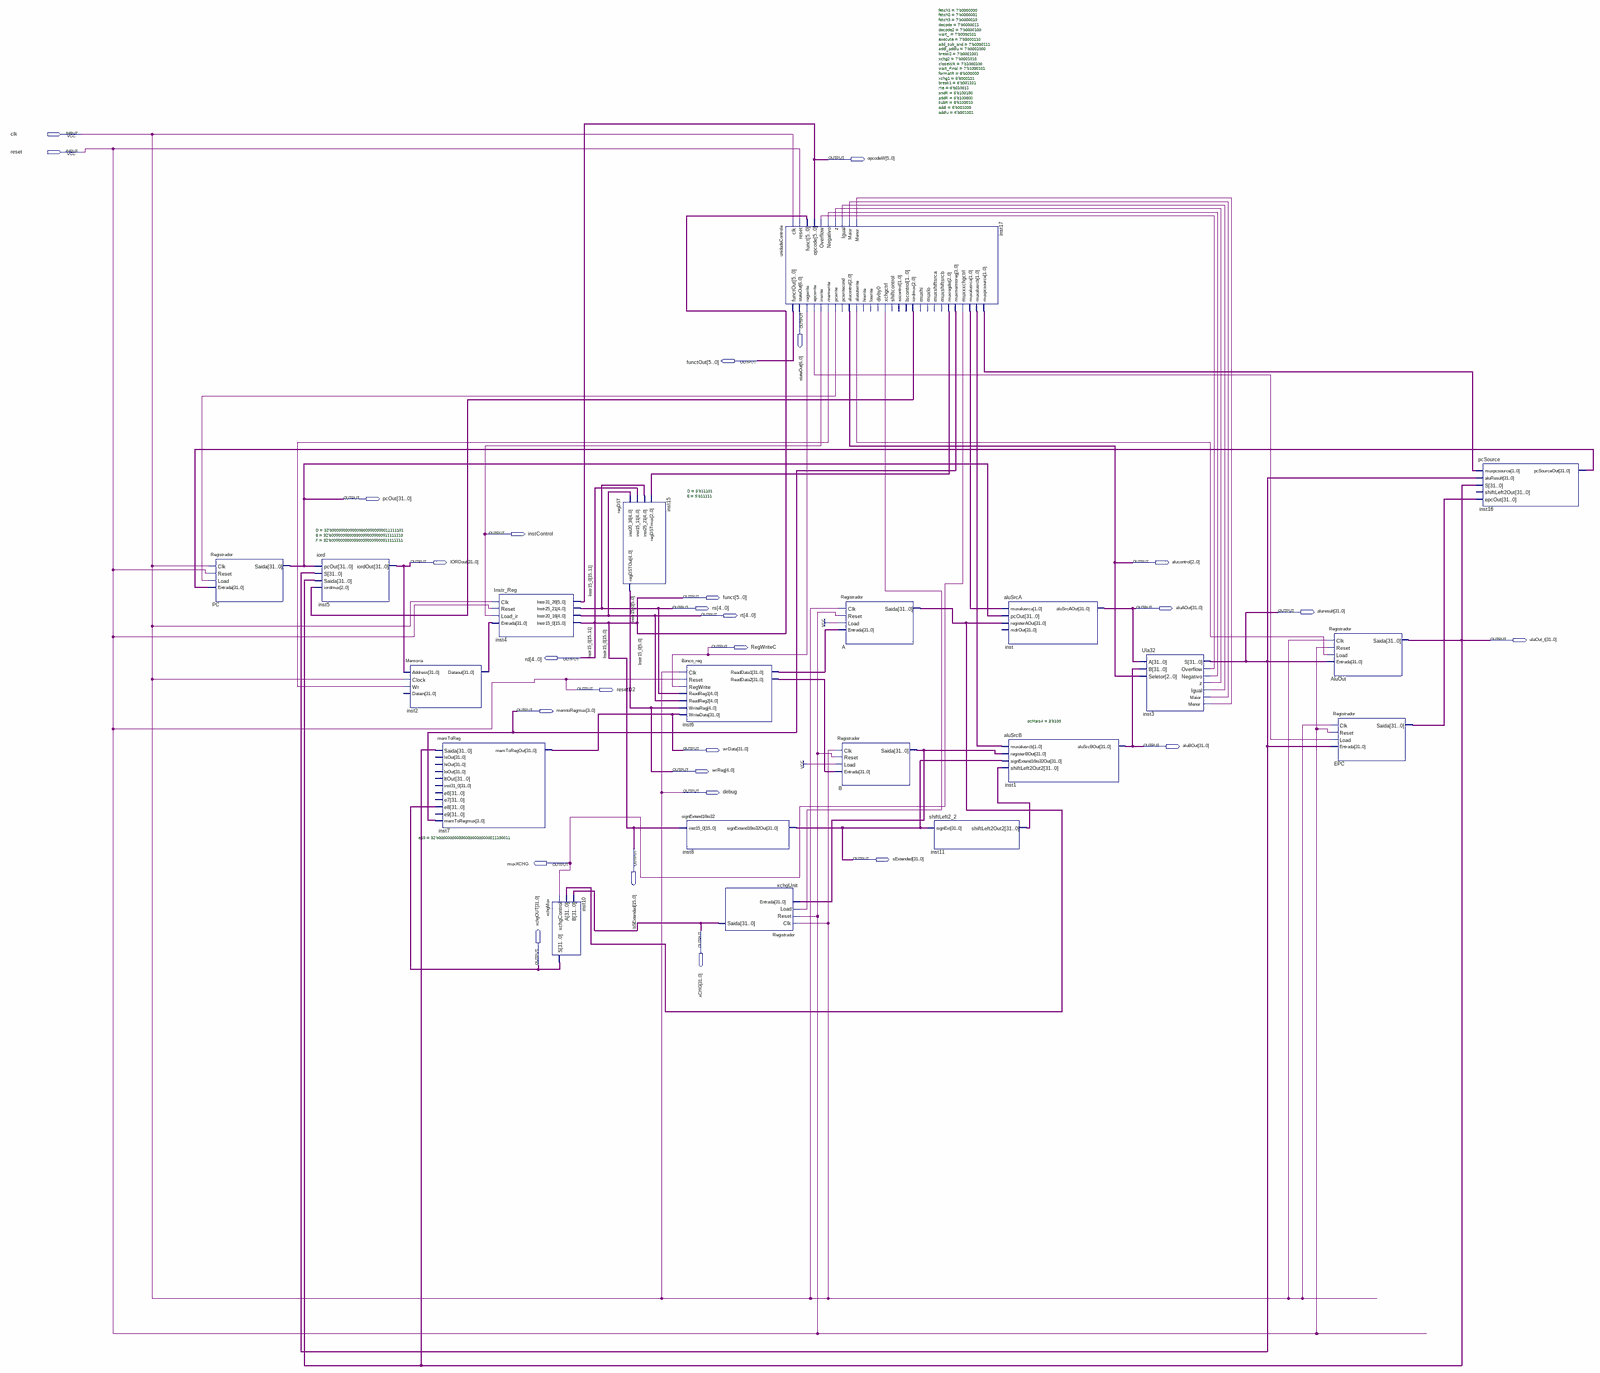
[diagram p0: schematic sheet, whole]
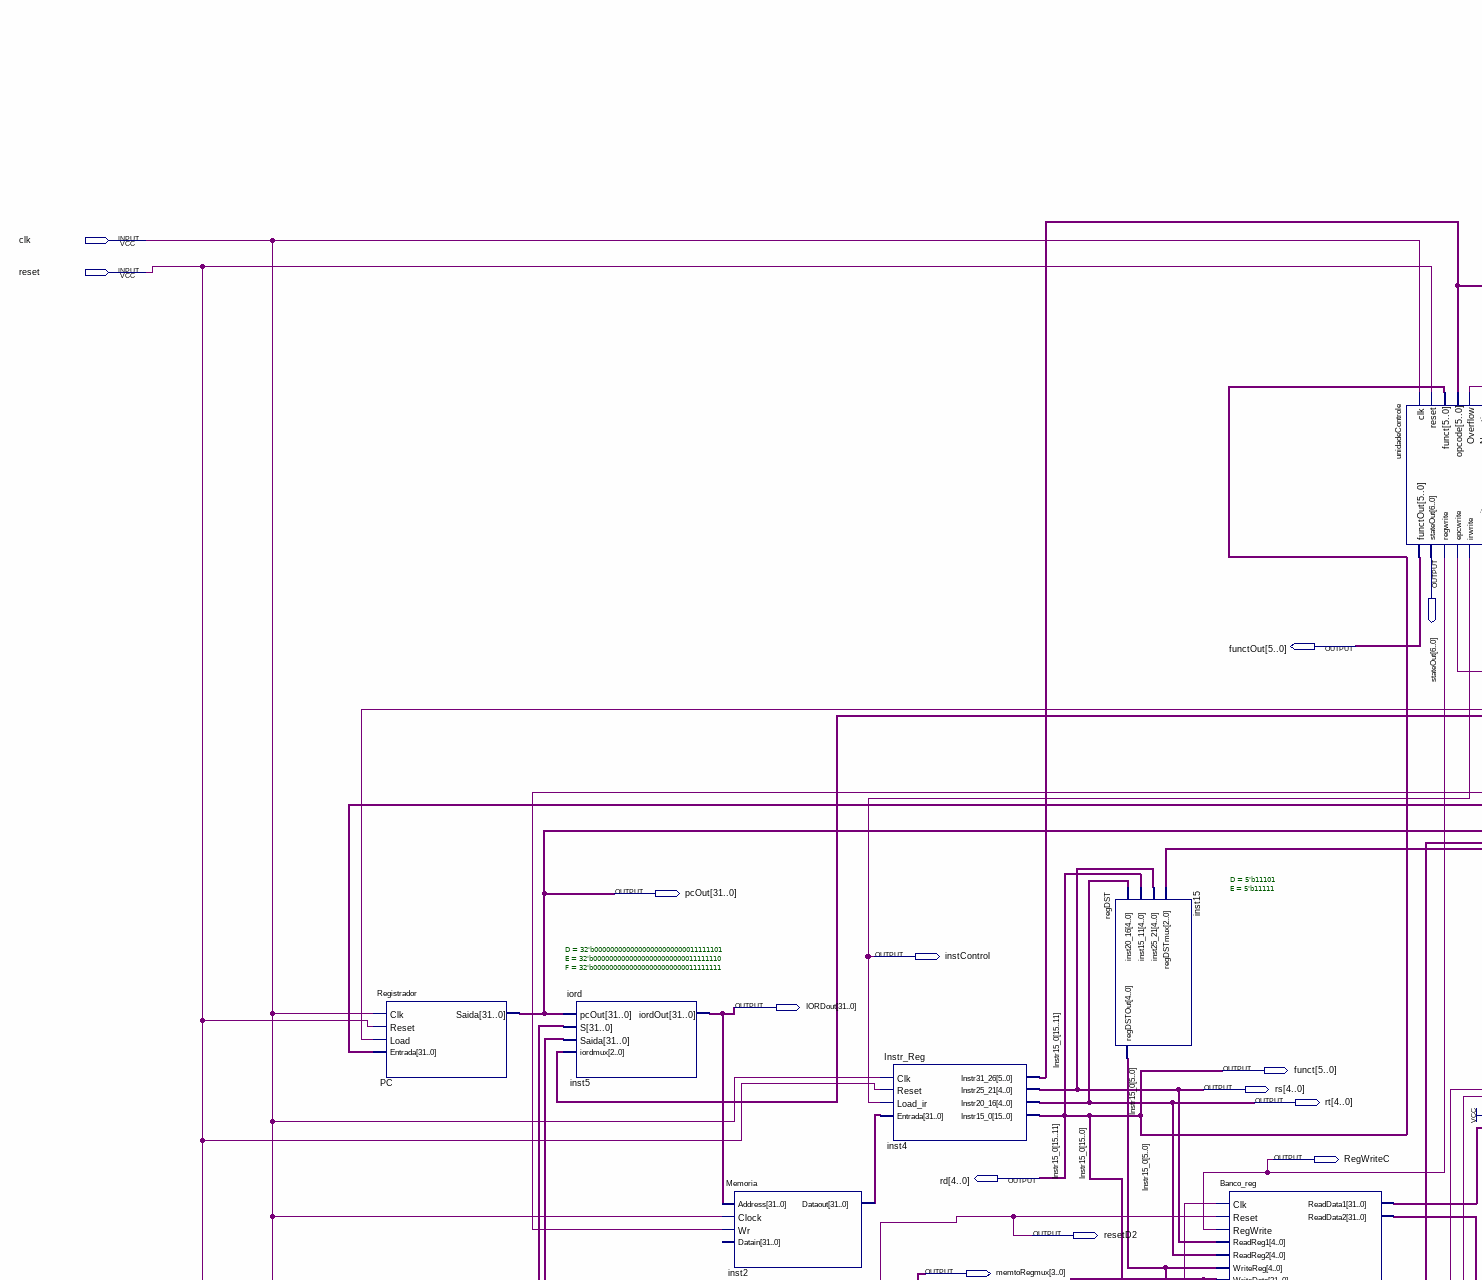
[diagram p1: schematic sheet, upper left part]
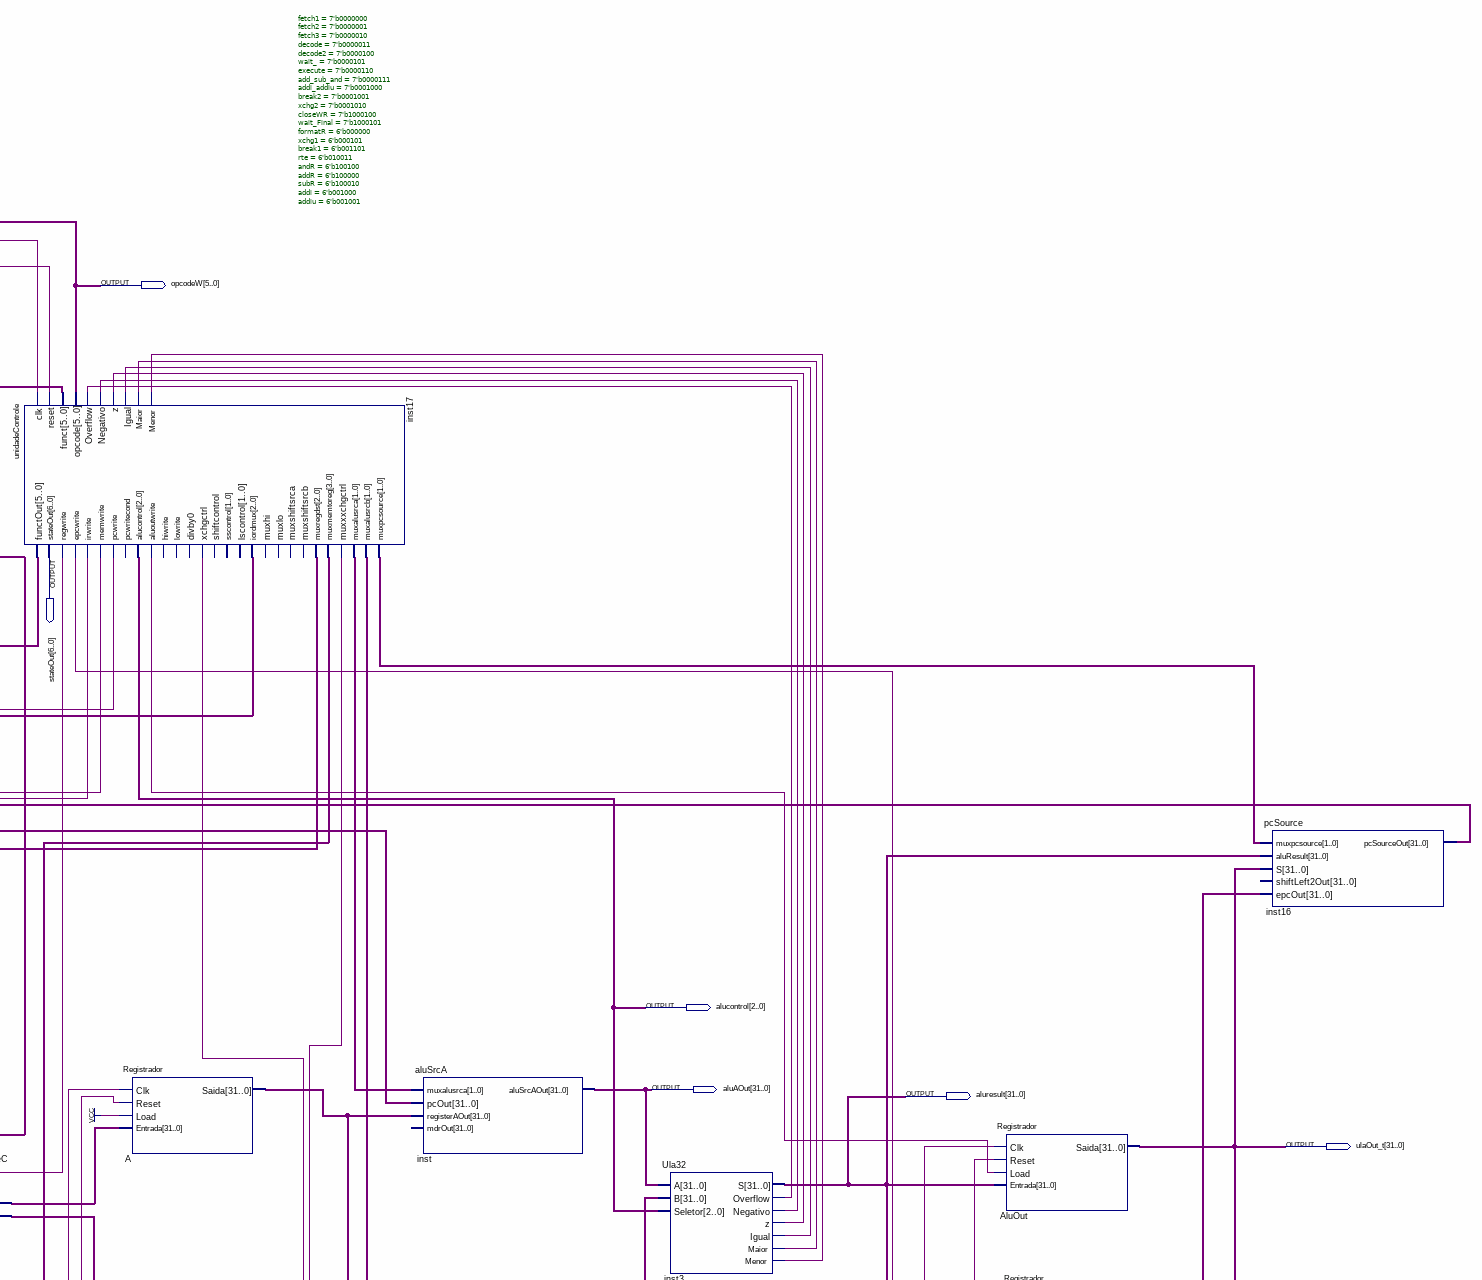
[diagram p2: schematic sheet, upper right part]
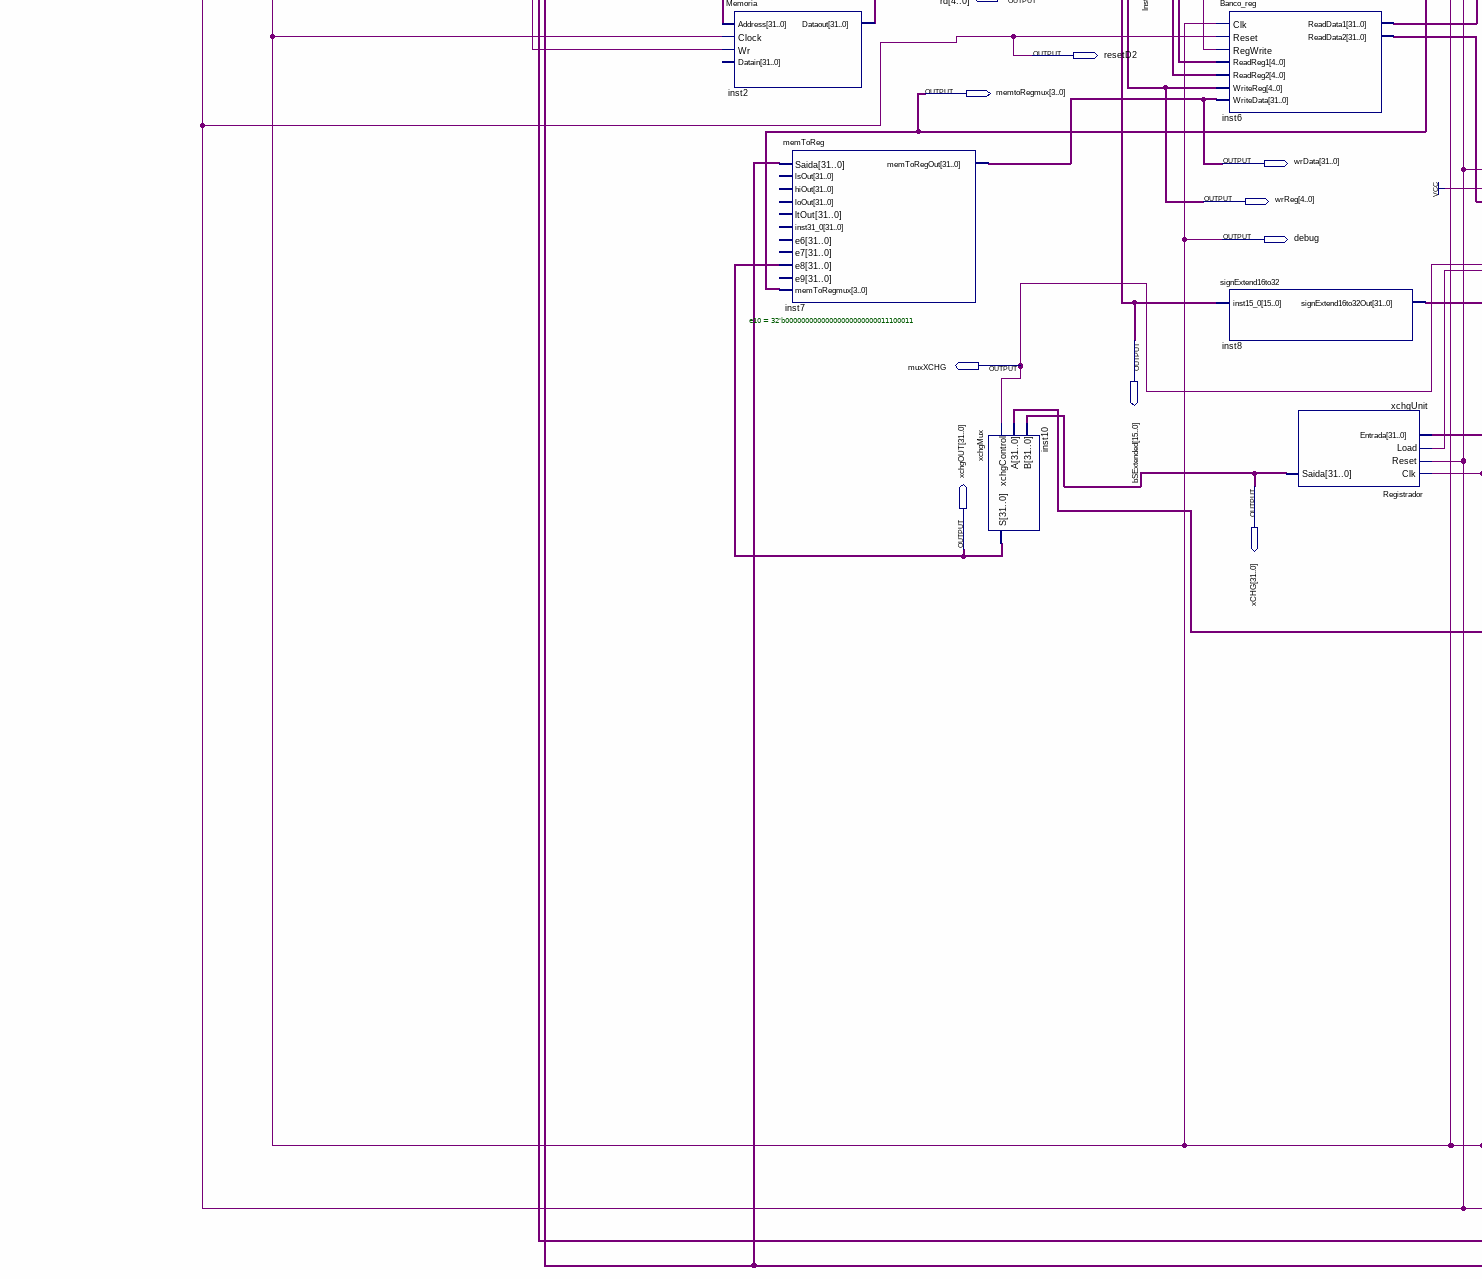
[diagram p3: schematic sheet, lower left part]
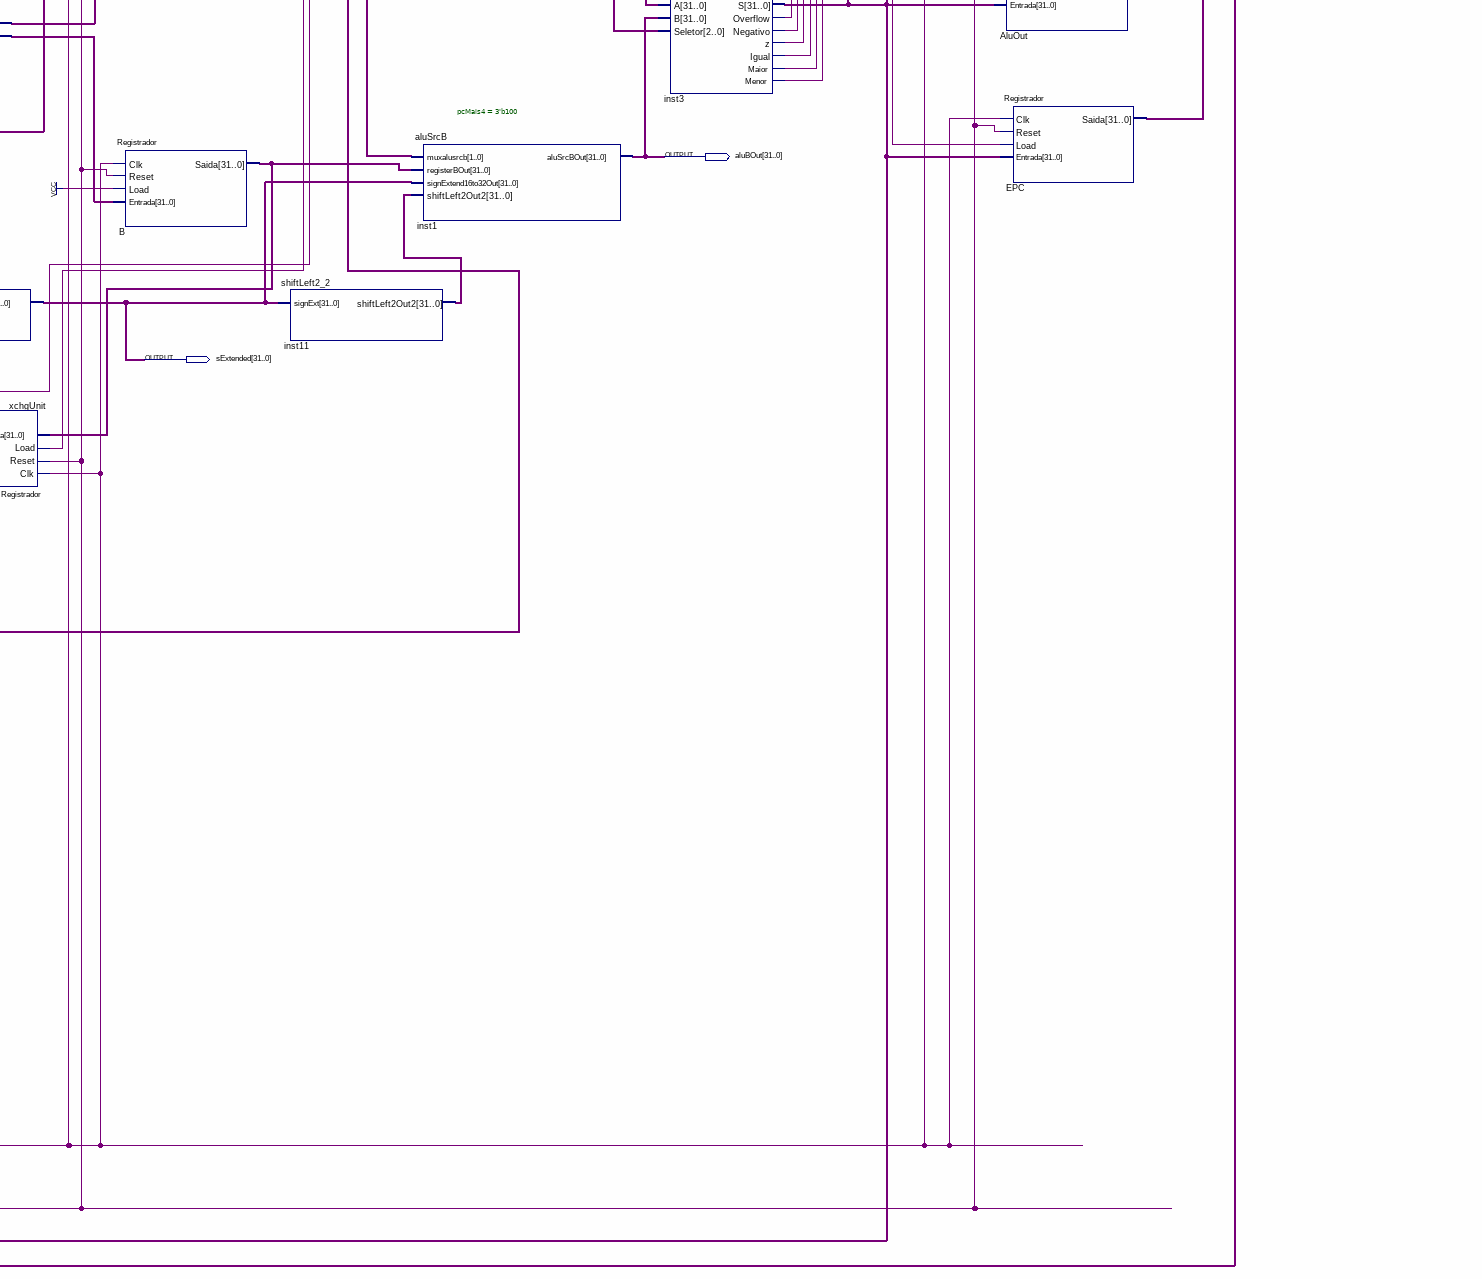
[diagram p4: schematic sheet, lower right part]
// Quartus schematic schemeHard.bdf as structural Verilog: 20 symbols, 28 pins
module schemeHard (
  input  clk,
  input  reset,
  output [5:0] opcodeW,
  output [6:0] stateOut,
  output [5:0] functOut,
  output [31:0] pcOut,
  output instControl,
  output [31:0] IORDout,
  output [2:0] alucontrol,
  output [5:0] funct,
  output [4:0] rs,
  output [31:0] aluAOut,
  output [31:0] aluresult,
  output [4:0] rt,
  output [31:0] ulaOut_t,
  output RegWriteC,
  output [4:0] rd,
  output resetD2,
  output [3:0] memtoRegmux,
  output [31:0] aluBOut,
  output [31:0] wrData,
  output [4:0] wrReg,
  output debug,
  output [15:0] bSExtended,
  output [31:0] sExtended,
  output muxXCHG,
  output [31:0] xCHG,
  output [31:0] xchgOUT
);

  wire inst3_igual, inst3_maior, inst3_menor, inst3_negativo, inst3_overflow, inst3_z, inst17_aluoutwrite,
       inst17_epcwrite, inst17_memwrite, inst17_pcwrite, inst17_xchgctrl;
  wire [1:0] inst17_muxalusrca, inst17_muxalusrcb, inst17_muxpcsource;
  wire [2:0] inst17_iordmux, inst17_muxregdst;
  wire [31:0] A_saida, B_saida, EPC_saida, inst2_dataout, inst6_readdata1, inst6_readdata2,
       inst11_shiftleft2out2, inst16_pcsourceout;

  Registrador PC (.Clk(clk), .Reset(reset), .Load(inst17_pcwrite), .Entrada(inst16_pcsourceout), .Saida(pcOut));
  iord #(.D(32'b00000000000000000000000011111101), .E(32'b00000000000000000000000011111110), .F(32'b00000000000000000000000011111111)) inst5 (
    .pcOut(pcOut), .S(aluresult), .Saida(ulaOut_t), .iordmux(inst17_iordmux), .iordOut(IORDout));
  Memoria inst2 (.Address(IORDout), .Clock(clk), .Wr(inst17_memwrite), .Dataout(inst2_dataout));  // open: Datain
  memToReg #(.e10(32'b00000000000000000000000011100011)) inst7 (
    .Saida(ulaOut_t), .e8(xchgOUT), .memToRegmux(memtoRegmux), .memToRegOut(wrData));  // open: lsOut, hiOut, loOut, ltOut, inst31_0, e6, e7, e9
  Instr_Reg inst4 (
    .Clk(clk), .Reset(reset), .Load_ir(instControl), .Entrada(inst2_dataout), .Instr31_26(opcodeW),
    .Instr25_21(rs), .Instr20_16(rt), .Instr15_0(bSExtended));
  xchgMux inst10 (.xchgControl(muxXCHG), .A(A_saida), .B(xCHG), .S(xchgOUT));
  regDST #(.D(5'b11101), .E(5'b11111)) inst15 (
    .inst20_16(rt), .inst15_11(bSExtended[15:11]), .inst25_21(rs), .regDSTmux(inst17_muxregdst),
    .regDSTOut(wrReg));
  Banco_reg inst6 (
    .Clk(clk), .Reset(reset), .RegWrite(RegWriteC), .ReadReg1(rs), .ReadReg2(rt), .WriteReg(wrReg),
    .WriteData(wrData), .ReadData1(inst6_readdata1), .ReadData2(inst6_readdata2));
  signExtend16to32 inst8 (.inst15_0(bSExtended), .signExtend16to32Out(sExtended));
  Registrador xchgUnit (.Clk(clk), .Reset(reset), .Load(inst17_xchgctrl), .Entrada(B_saida), .Saida(xCHG));
  unidadeControle #(.fetch1(7'b0000000), .fetch2(7'b0000001), .fetch3(7'b0000010), .decode(7'b0000011), .decode2(7'b0000100), .wait_(7'b0000101), .execute(7'b0000110), .add_sub_and(7'b0000111), .addi_addiu(7'b0001000), .break2(7'b0001001), .xchg2(7'b0001010), .closeWR(7'b1000100), .wait_Final(7'b1000101), .formatR(6'b000000), .xchg1(6'b000101), .break1(6'b001101), .rte(6'b010011), .andR(6'b100100), .addR(6'b100000), .subR(6'b100010), .addi(6'b001000), .addiu(6'b001001)) inst17 (
    .clk(clk), .reset(reset), .funct(bSExtended[5:0]), .opcode(opcodeW), .Overflow(inst3_overflow),
    .Negativo(inst3_negativo), .z(inst3_z), .Igual(inst3_igual), .Maior(inst3_maior), .Menor(inst3_menor),
    .functOut(functOut), .stateOut(stateOut), .regwrite(RegWriteC), .epcwrite(inst17_epcwrite),
    .irwrite(instControl), .memwrite(inst17_memwrite), .pcwrite(inst17_pcwrite), .alucontrol(alucontrol),
    .aluoutwrite(inst17_aluoutwrite), .xchgctrl(inst17_xchgctrl), .iordmux(inst17_iordmux),
    .muxregdst(inst17_muxregdst), .muxmemtoreg(memtoRegmux), .muxxxchgctrl(muxXCHG),
    .muxalusrca(inst17_muxalusrca), .muxalusrcb(inst17_muxalusrcb), .muxpcsource(inst17_muxpcsource));  // open: pcwritecond, hiwrite, lowrite, divby0, shiftcontrol, sscontrol, lscontrol, muxhi, muxlo, muxshiftsrca, muxshiftsrcb
  Registrador A (.Clk(clk), .Reset(reset), .Load(1'b1), .Entrada(inst6_readdata1), .Saida(A_saida));
  Registrador B (.Clk(clk), .Reset(reset), .Load(1'b1), .Entrada(inst6_readdata2), .Saida(B_saida));
  shiftLeft2_2 inst11 (.signExt(sExtended), .shiftLeft2Out2(inst11_shiftleft2out2));
  aluSrcA inst (
    .muxalusrca(inst17_muxalusrca), .pcOut(pcOut), .registerAOut(A_saida), .aluSrcAOut(aluAOut));  // open: mdrOut
  aluSrcB #(.pcMais4(3'b100)) inst1 (
    .muxalusrcb(inst17_muxalusrcb), .registerBOut(B_saida), .signExtend16to32Out(sExtended),
    .shiftLeft2Out2(inst11_shiftleft2out2), .aluSrcBOut(aluBOut));
  Ula32 inst3 (
    .A(aluAOut), .B(aluBOut), .Seletor(alucontrol), .S(aluresult), .Overflow(inst3_overflow),
    .Negativo(inst3_negativo), .z(inst3_z), .Igual(inst3_igual), .Maior(inst3_maior), .Menor(inst3_menor));
  Registrador AluOut (.Clk(clk), .Reset(reset), .Load(inst17_aluoutwrite), .Entrada(aluresult), .Saida(ulaOut_t));
  Registrador EPC (.Clk(clk), .Reset(reset), .Load(inst17_epcwrite), .Entrada(aluresult), .Saida(EPC_saida));
  pcSource inst16 (
    .muxpcsource(inst17_muxpcsource), .aluResult(aluresult), .S(ulaOut_t), .epcOut(EPC_saida),
    .pcSourceOut(inst16_pcsourceout));  // open: shiftLeft2Out

  assign debug = clk;
  assign funct = bSExtended[5:0];
  assign rd = bSExtended[15:11];
  assign resetD2 = reset;

  // Other names for the same wires on the sheet: Instr15_0[15:0] = bSExtended
endmodule
